# Altium schematic sheet #NIP涡轮驱动板-Power.SchDoc
size A3; SPICEModelCacheKVCDXOIC: <root> / <DocumentId>KVCDXOIC</DocumentId> / <CacheFrame Number="0"> / <Model Name="4020_74438356150_15u" Kind="CKT"> / <Text>******* / .subckt 4020_74438356150_15u 1 2 / Rp 1 2 14200 / Cp 1 2 9.62p / Rs 1 N3 0.2 / L1 N3 2 14.1u / .ends 4020_74438356150_15u</Text> / </Model> / <Model Name="5030_74438367100_10u" Kind="CKT"> / <Text>******* / .subckt 5030_74438367100_10u 1 2 / Rp 1 2 7290 / Cp 1 2 15.66p / Rs 1 N3 0.061 / L1 N3 2 9.563u / .ends 5030_74438367100_10u</Text> / </Model> / </CacheFrame> / </root>
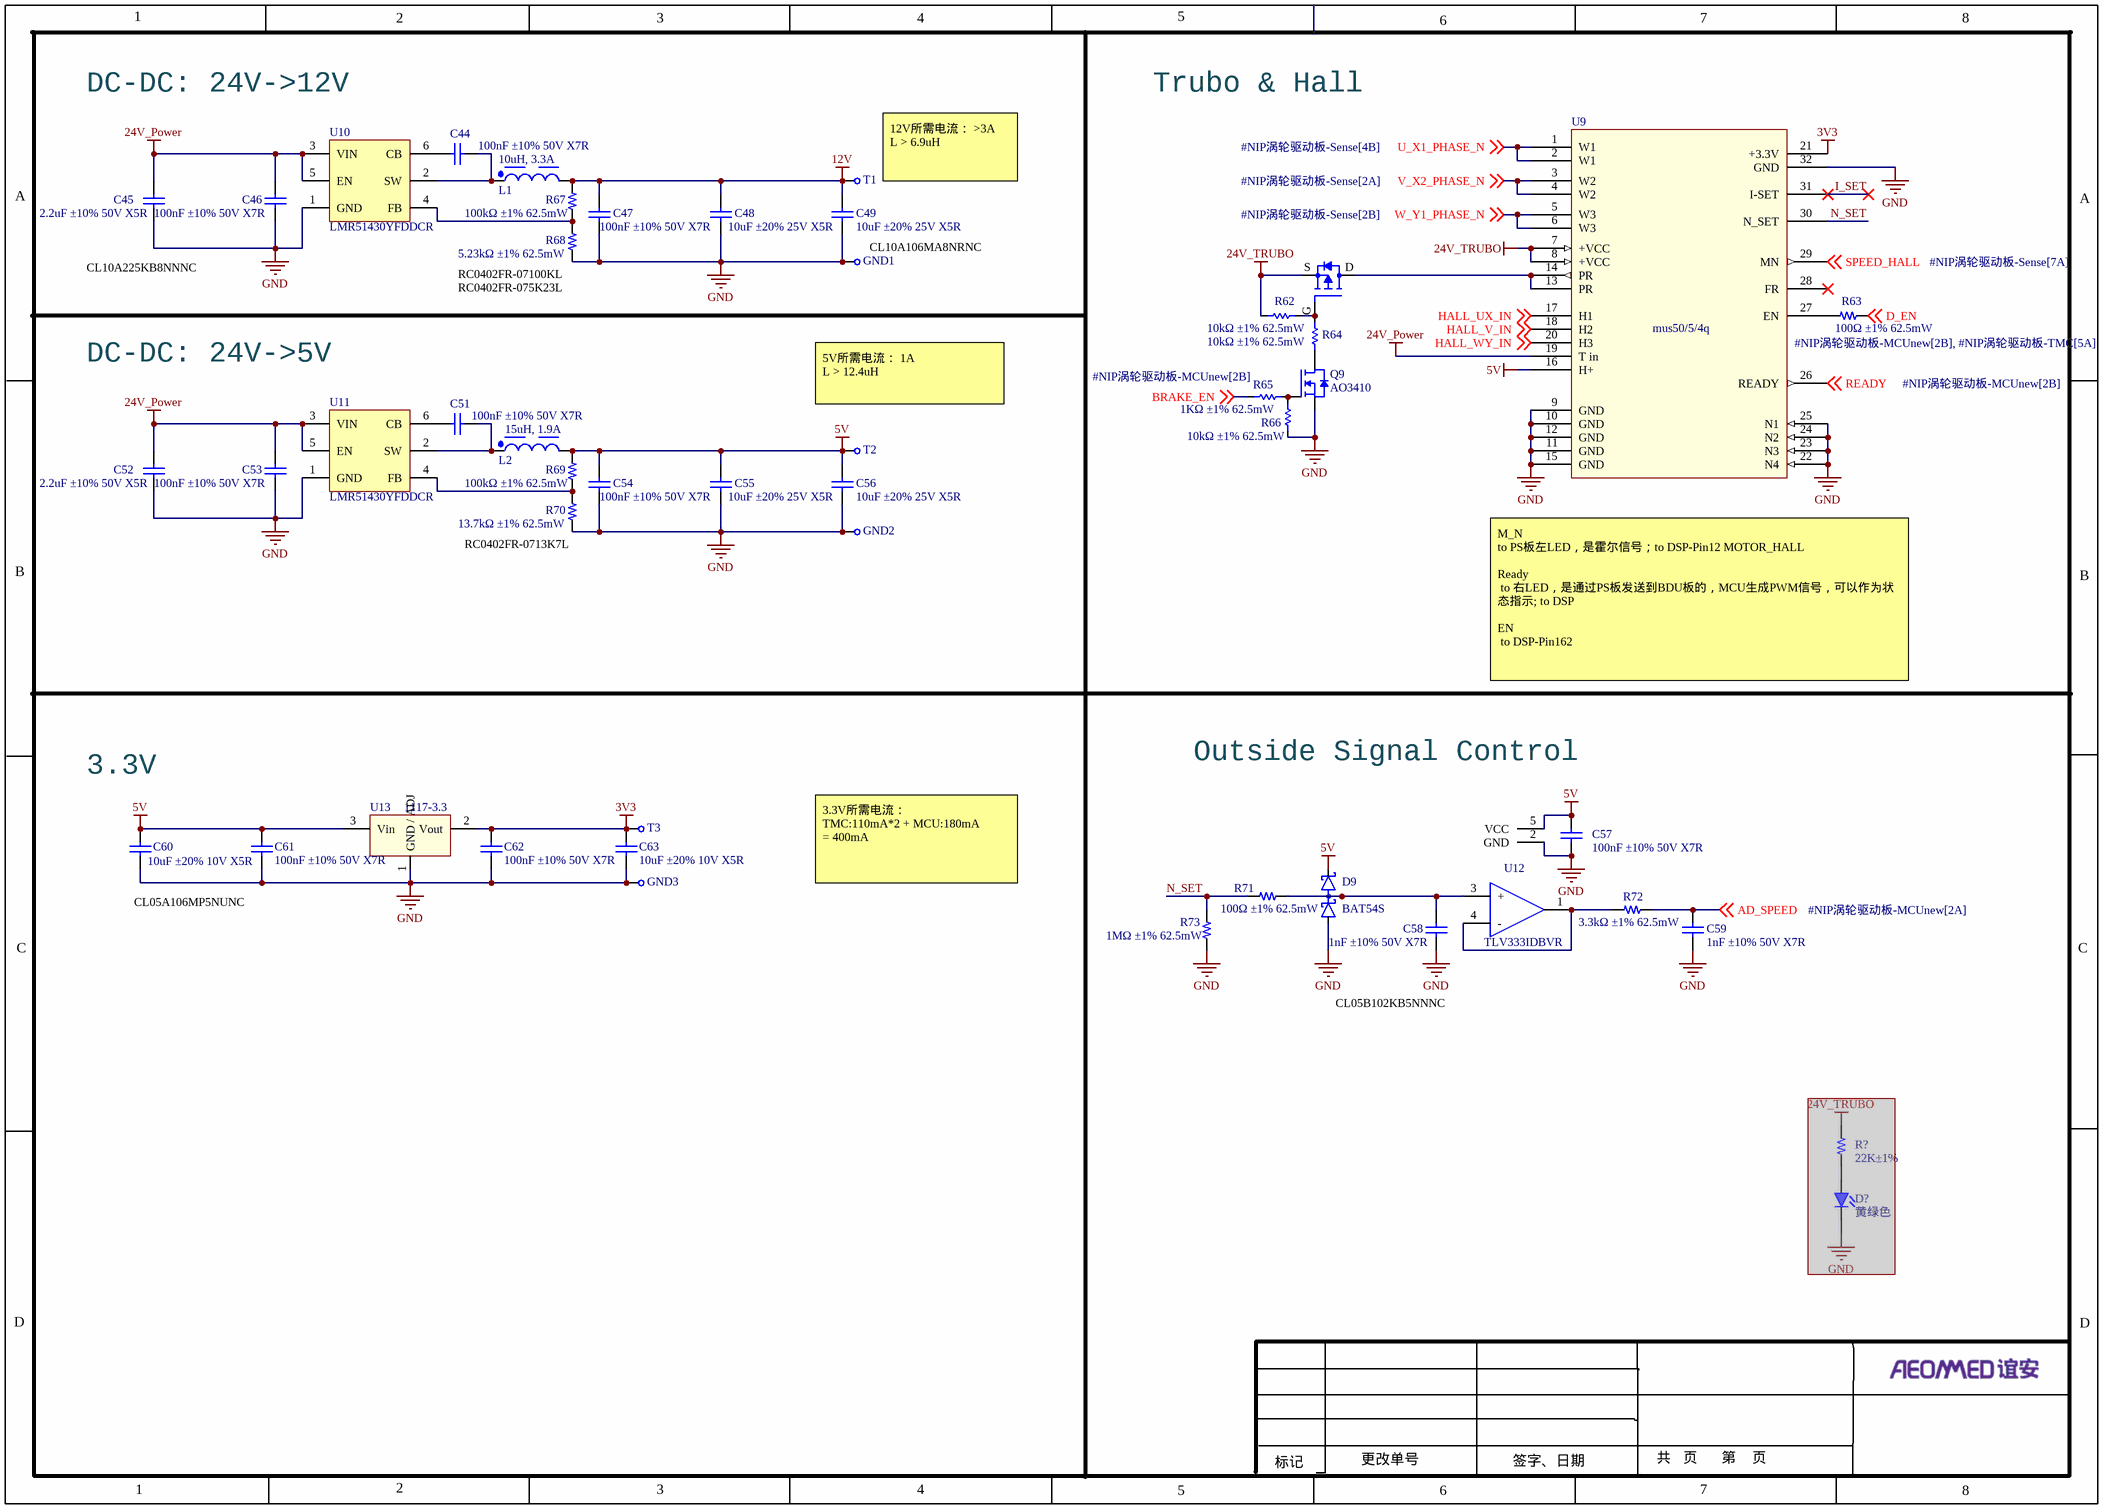
[diagram p0: #NIP涡轮驱动板-Power.SchDoc]

## Parts
C44  100nF ±10% 50V X7R  [C0402]
C45  2.2uF ±10% 50V X5R  [C0603]
C46  100nF ±10% 50V X7R  [C0402]
C47  100nF ±10% 50V X7R  [C0402]
C48  10uF ±20% 25V X5R  [C0603]
C49  10uF ±20% 25V X5R  [C0603]
C51  100nF ±10% 50V X7R  [C0402]
C52  2.2uF ±10% 50V X5R  [C0603]
C53  100nF ±10% 50V X7R  [C0402]
C54  100nF ±10% 50V X7R  [C0402]
C55  10uF ±20% 25V X5R  [C0603]
C56  10uF ±20% 25V X5R  [C0603]
C57  100nF ±10% 50V X7R  [C0402]
C58  1nF ±10% 50V X7R  [C0402]
C59  1nF ±10% 50V X7R  [C0402]
C60  10uF ±20% 10V X5R  [C0402]
C61  100nF ±10% 50V X7R  [C0402]
C62  100nF ±10% 50V X7R  [C0402]
C63  10uF ±20% 10V X5R  [C0402]
D9  BAT54S  [SOT23-3]
D?  黄绿色  [LED-0805]  (masked out: inside a compile mask, not in the netlist)
GND1  test_point  [TP-SIP-1-GND]  (value not drawn)
GND2  test_point  [TP-SIP-1-GND]  (value not drawn)
GND3  test_point  [TP-SIP-1-GND]  (value not drawn)
L1  10uH, 3.3A  [WE-MAPI_5030]
L2  15uH, 1.9A  [WE-MAPI_4020]
Q8  SI7463ADP-T1-GE3  [POWERPAK-SO-8_L6.1-W5.1-P1.27-BL-EP]  (value not drawn)
Q9  AO3410  [SOT23-3]
R62  10kΩ ±1% 62.5mW  [R0402]
R63  100Ω ±1% 62.5mW  [R0402]
R64  10kΩ ±1% 62.5mW  [R0402]
R65  1KΩ ±1% 62.5mW  [R0402]
R66  10kΩ ±1% 62.5mW  [R0402]
R67  100kΩ ±1% 62.5mW  [R0402]
R68  5.23kΩ ±1% 62.5mW  [R0402]
R69  100kΩ ±1% 62.5mW  [R0402]
R70  13.7kΩ ±1% 62.5mW  [R0402]
R71  100Ω ±1% 62.5mW  [R0402]
R72  3.3kΩ ±1% 62.5mW  [R0402]
R73  1MΩ ±1% 62.5mW  [R0402]
R?  22K±1%  [R-0603]  (masked out: inside a compile mask, not in the netlist)
T1  test_point  [TP-SIP-1-Small]  (value not drawn)
T2  test_point  [TP-SIP-1-Small]  (value not drawn)
T3  test_point  [TP-SIP-1-Small]  (value not drawn)
U9  mus50/5/4q  [MUS50/5/4Q]
U10  LMR51430YFDDCR  [SOT-23-6_L2.9-W1.6-P0.95-LS2.9-BL]
U11  LMR51430YFDDCR  [SOT-23-6_L2.9-W1.6-P0.95-LS2.9-BL]
U12  TLV333IDBVR  [SOT23-5]
U13  1117-3.3  [SOT-89-3_L4.5-W2.5-P1.50-LS4.0-BR]

## Nets
3V3: C62.2 C63.2 T3.1 U9.21(+3.3V) U13.2(Vout)
5V: C54.2 C55.2 C56.2 C57.2 C60.2 C61.2 D9.2(C2) L2.2 R69.2 T2.1 U9.16(H+) U12.5(VCC) U13.3(Vin)
12V: C47.2 C48.2 C49.2 L1.2 R67.2 T1.1
24V_Power: C45.2 C46.2 C52.2 C53.2 U9.19(T_in) U10.3(VIN) U10.5(EN) U11.3(VIN) U11.5(EN)
24V_TRUBO: Q8.S R62.2 U9.7(+VCC) U9.8(+VCC)
GND: C45.1 C46.1 C47.1 C48.1 C49.1 C52.1 C53.1 C54.1 C55.1 C56.1 C57.1 C58.1 C59.1 C60.1 C61.1 C62.1 C63.1 D9.1(A1) GND1.1 GND2.1 GND3.1 Q9.2(S) R66.2 R68.2 R70.2 R73.1 U9.9(GND) U9.10(GND) U9.11(GND) U9.12(GND) U9.15(GND) U9.22(N4) U9.23(N3) U9.24(N2) U9.25(N1) U9.32(GND) U10.1(GND) U11.1(GND) U12.2(GND) U13.1(GND_/_ADJ)
AD_SPEED: C59.2 R72.1 ; off-sheet AD_SPEED
BRAKE_EN: R65.1 ; off-sheet BRAKE_EN
D_EN: R63.1 ; off-sheet D_EN
HALL_UX_IN: U9.17(H1) ; off-sheet HALL_UX_IN
HALL_V_IN: U9.18(H2) ; off-sheet HALL_V_IN
HALL_WY_IN: U9.20(H3) ; off-sheet HALL_WY_IN
I_SET: U9.31(I-SET)
N_SET: R71.1 R73.2 U9.30(N_SET)
READY: U9.26(READY) ; off-sheet READY
SPEED_HALL: U9.29(MN) ; off-sheet SPEED_HALL
U_X1_PHASE_N: U9.1(W1) U9.2(W1) ; off-sheet U_X1_PHASE_N
V_X2_PHASE_N: U9.3(W2) U9.4(W2) ; off-sheet V_X2_PHASE_N
W_Y1_PHASE_N: U9.5(W3) U9.6(W3) ; off-sheet W_Y1_PHASE_N
NetC44_1: C44.1 L1.1 U10.2(SW)
NetC44_2: C44.2 U10.6(CB)
NetC51_1: C51.1 L2.1 U11.2(SW)
NetC51_2: C51.2 U11.6(CB)
NetC58_2: C58.2 D9.3(C1A2) R71.2 U12.3(+)
NetQ8_D: Q8.D U9.13(PR) U9.14(PR)
NetQ8_G: Q8.G R62.1 R64.1
NetQ9_1: Q9.1(G) R65.2 R66.1
NetQ9_3: Q9.3(D) R64.2
NetR63_2: R63.2 U9.27(EN)
NetR67_1: R67.1 R68.1 U10.4(FB)
NetR69_1: R69.1 R70.1 U11.4(FB)
NetR72_2: R72.2 U12.1 U12.4(-)

Not connected (* = marked no-connect by the designer): U9 28(FR)*

## Notes on the sheet
- DC-DC: 24V->12V
- Trubo & Hall
- (near T1) 12V所需电流： >3A
  L > 6.9uH
- (near C45) CL10A225KB8NNNC
- (near R68) RC0402FR-07100KL
- (near R68) RC0402FR-075K23L
- (near GND1) CL10A106MA8NRNC
- DC-DC: 24V->5V
- 5V所需电流： 1A
  L > 12.4uH
- (near R70) RC0402FR-0713K7L
- M_N
  to PS板左LED，是霍尔信号；to DSP-Pin12 MOTOR_HALL
  Ready
  to 右LED，是通过PS板发送到BDU板的，MCU生成PWM信号，可以作为状态指示; to DSP
  EN
  to DSP-Pin162
- 3.3V
- Outside Signal Control
- CL05A106MP5NUNC
- 3.3V所需电流：
  TMC:110mA*2 + MCU:180mA
  = 400mA
- CL05B102KB5NNNC
- 1
- 2
- 3
- 4
- 5
- 6
- 7
- 8
- A
- B
- C
- D
- 更改单号
- 共   页      第    页
- 标记
- 签字、日期

## Library data of the parts
C44 C46 C47 C51 C53 C54 C57 C61 C62 = Cap: Capacitor; Published: 8-Jun-2000; LatestRevisionDate: 17-Jul-2002; LatestRevisionNote: Re-released for DXP Platform.; PackageReference: RAD-0.3; Publisher: Altium Limited; PackageDescription: Radial Cap, Thru-Hole; 2 Leads; 0.3 in Pin Spacing
C45 C52 = Cap: CL10A225KB8NNNC; Published: 8-Jun-2000; LatestRevisionDate: 17-Jul-2002; LatestRevisionNote: Re-released for DXP Platform.; PackageReference: RAD-0.3; Publisher: Altium Limited; PackageDescription: Radial Cap, Thru-Hole; 2 Leads; 0.3 in Pin Spacing
C48 C49 C55 C56 = Cap: CL10A106MA8NRNC; Published: 8-Jun-2000; LatestRevisionDate: 17-Jul-2002; LatestRevisionNote: Re-released for DXP Platform.; PackageReference: RAD-0.3; Publisher: Altium Limited; PackageDescription: Radial Cap, Thru-Hole; 2 Leads; 0.3 in Pin Spacing
C58 C59 = Cap: CL05B102KB5NNNC; Published: 8-Jun-2000; LatestRevisionDate: 17-Jul-2002; LatestRevisionNote: Re-released for DXP Platform.; PackageReference: RAD-0.3; Publisher: Altium Limited; PackageDescription: Radial Cap, Thru-Hole; 2 Leads; 0.3 in Pin Spacing
C60 C63 = Cap: CL05A106MP5NUNC; Published: 8-Jun-2000; LatestRevisionDate: 17-Jul-2002; LatestRevisionNote: Re-released for DXP Platform.; PackageReference: RAD-0.3; Publisher: Altium Limited; PackageDescription: Radial Cap, Thru-Hole; 2 Leads; 0.3 in Pin Spacing
D9 = BAT54S: 品牌：NXP，型号：BAT54S，0.11A,30V，ROHS; MF: NXP; MPN: BAT54S
D? = LED-0805: 品牌:Everlight（亿光），型号17-21SYGC/S530-E2/TR8，Typ.23mcd@20mA，ROHS
GND1-GND3 T1-T3 = TP-SIP-1-Small
L1 = 74438367100: WE-MAPI, size 5030, 10uH, 3.3A, 70.2mOhm; Manufacturer: Wurth Elektronik; Case/Size Code: 5030; DC Resistance: 61mOhm; Saturation Current: 4.8A; Self Resonant Frequency: 13MHz; Manufacturer Part Number: 74438367100; Match Code: WE-MAPI; ComponentLink1Description: Website Link; ComponentLink1URL: https://www.we-online.com/redexpert/article/74438367100?ad; ComponentLink2Description: Datasheet Link; ComponentLink2URL: https://www.we-online.com/redexpert/spec/74438367100?ad; Mount: Surface Mount; Operating Temperature Max: 125°C; Operating Temperature Min: -40°C; Packaging: Tape and Reel; Length: 5.4mm; Width: 5.4mm; Height: 3.1mm; DC Resistance Max: 70.2mOhm; Inductance: 10uH; Rated Current: 3.3A
L2 = 74438356150: WE-MAPI, size 4020, 15uH, 1.9A, 230mOhm; Manufacturer: Wurth Elektronik; Case/Size Code: 4020; DC Resistance: 200mOhm; Saturation Current: 2.1A; Self Resonant Frequency: 14MHz; Manufacturer Part Number: 74438356150; Match Code: WE-MAPI; ComponentLink1Description: Website Link; ComponentLink1URL: https://www.we-online.com/redexpert/article/74438356150?ad; ComponentLink2Description: Datasheet Link; ComponentLink2URL: https://www.we-online.com/redexpert/spec/74438356150?ad; Mount: Surface Mount; Operating Temperature Max: 125°C; Operating Temperature Min: -40°C; Packaging: Tape and Reel; Length: 4.1mm; Width: 4.1mm; Height: 2.1mm; DC Resistance Max: 230mOhm; Inductance: 15uH; Rated Current: 1.9A
Q8 = MOSFET-P: 类型 P沟道 / 漏源电压(Vdss) 40V / 连续漏极电流(Id) 46A / 功率(Pd) 5W；39W / 导通电阻(RDS(on)@Vgs,Id) 10mΩ@15A,10V / 阈值电压(Vgs(th)@Id) 2.3V@250uA; Manufacturer: VISHAY(威世); Add into BOM: yes; Total Gate Charge (Qg@Vgs): 144nC@10V; Input Capacitance (Ciss@Vds): 4.15nF@20V; Symbol: SI7463ADP-T1-GE3; Device: SI7463ADP-T1-GE3; Supplier: LCSC; Supplier Part: C469466; Manufacturer Part: SI7463ADP-T1-GE3; JLCPCB Part Class: Extended Part; LCSC Part Name: P沟道 耐压:40V 电流:46A; Supplier Footprint: PowerPAK-SO-8; Datasheet: https://atta.szlcsc.com/upload/public/pdf/source/20201103/C469466_DEB614A703506C939C03FF0A9B0AE822.pdf; Convert to PCB: yes; Type: P沟道; Drain Source Voltage (Vdss): 40V; Continuous Drain Current (Id): 46A; Power Dissipation (Pd): 5W；39W; Drain Source On Resistance (RDS(on)@Vgs,Id): 10mΩ@15A,10V; Gate Threshold Voltage (Vgs(th)@Id): 2.3V@250uA; Reverse Transfer Capacitance (Crss@Vds): -; Operating Temperature: -55℃~+150℃@(Tj)
R62 R64-R66 = Res_0402: Resistor; Published: 8-Jun-2000; LatestRevisionDate: 17-Jul-2002; LatestRevisionNote: Re-released for DXP Platform.; PackageReference: AXIAL-0.3; Publisher: Altium Limited; PackageDescription: Axial Device, Thru-Hole; 2 Leads; 0.3 in Pin Spacing
R63 R71-R73 R? = R-0603
R67 R69 = R-0603: RC0402FR-07100KL
R68 = R-0603: RC0402FR-075K23L
R70 = R-0603: RC0402FR-0713K7L
U9 = mus50/5/4q: 品牌：长江（CJT） / A: A2005WVA-12P / B: A2541WV-2x10P
U10 U11 = LMR51430Y: 输入电压 4.5V~36V / 输出电压 600mV~34.2V / 输出电流(最大值) 3A / 开关频率 1.1MHz / 工作温度 -40℃~+150℃ / 静态电流(Iq) 40uA
U12 = TLV333IDBVR: 品牌：TI，型号：TLV333IDBVR,SOIC-8,–25°~+85°C,单运放，ROHS
U13 = 1117_SOT89: SOT-89-3